# Altium project MotorsAdapter.PrjPcb
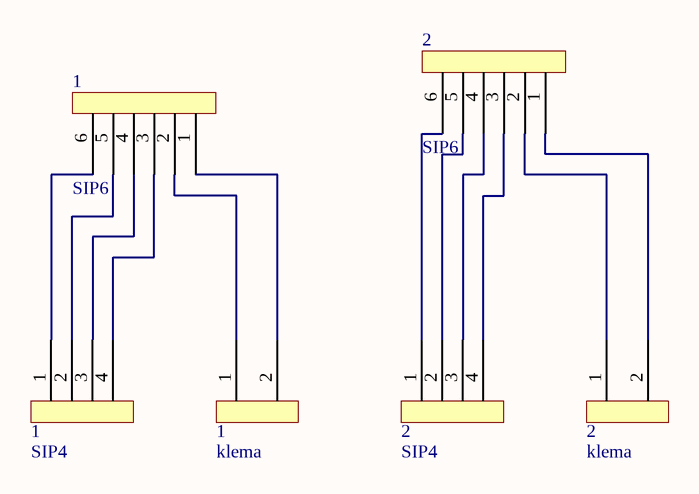
[diagram p0: MotorsAdapter.SchDoc]
1 sheet, 6 parts. Net scope: global (net labels, ports and power ports of the same name join across sheets).
Board file: MotorsAdapter.PcbDoc

## Sheet MotorsAdapter.SchDoc
size A

### Parts
(Parts that share a designator on the sheet are numbered #1, #2 ... from top to bottom, then left to right.)
1#1  SIP6  [SIP6]
1#2  SIP4  [SIP4]
1#3  klema  [klema]
2#1  SIP6  [SIP6]
2#2  SIP4  [SIP4]
2#3  klema  [klema]

### Nets
Net1#1_1: 1#1.1 1#3.2
Net1#1_2: 1#1.2 1#3.1
Net1#1_3: 1#1.3 1#2.4
Net1#1_4: 1#1.4 1#2.3
Net1#1_5: 1#1.5 1#2.2
Net1#1_6: 1#1.6 1#2.1
Net2#1_1: 2#1.1 2#3.2
Net2#1_2: 2#1.2 2#3.1
Net2#1_3: 2#1.3 2#2.4
Net2#1_4: 2#1.4 2#2.3
Net2#1_5: 2#1.5 2#2.2
Net2#1_6: 2#1.6 2#2.1